# EAGLE schematic aquapi2 (EAGLE 9.6.2)
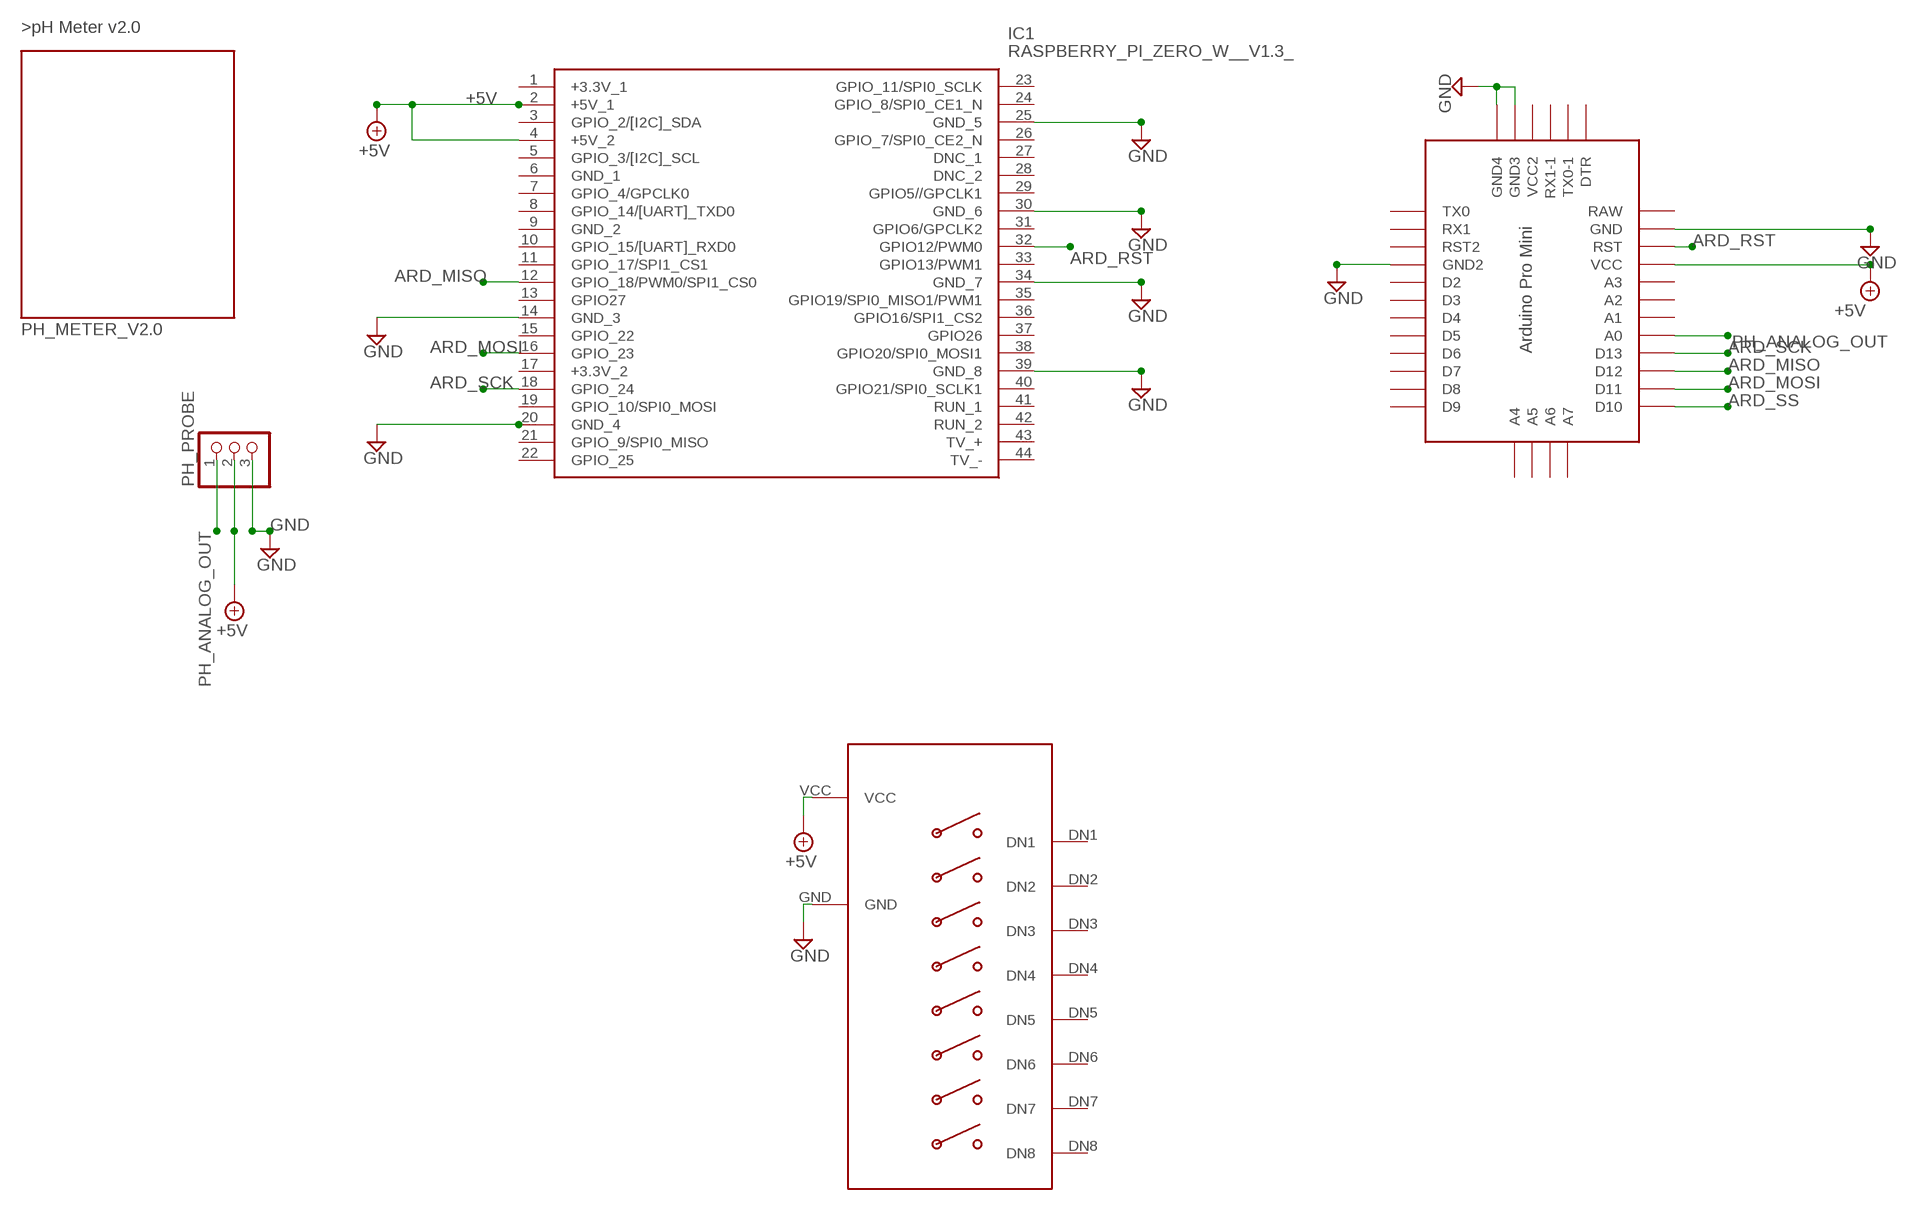
[diagram p0: schematic, sheet 1]

## Parts
IC1  RASPBERRY_PI_ZERO_W__V1.3_  [RASPBERRYPIZEROWV13]
PH_PROBE  PINHD-1X3  [1X03]
U$1  PH_METER_V2.0  [PH_METER_V2.0]
U$2  PRO-MINI  [PRO-MINI]
U$3  RELAY_X8  [RELAY_X8]

## Nets
+5V: IC1.2(+5V_1) IC1.4(+5V_2) PH_PROBE.2 U$2.VCC U$3.VCC
ARD_MISO: IC1.12(GPIO_18/PWM0/SPI1_CS0) U$2.D12
ARD_MOSI: IC1.16(GPIO_23) U$2.D11
ARD_RST: IC1.32(GPIO12/PWM0) U$2.RST
ARD_SCK: IC1.18(GPIO_24) U$2.D13
ARD_SS: U$2.D10
GND: IC1.14(GND_3) IC1.20(GND_4) IC1.25(GND_5) IC1.30(GND_6) IC1.34(GND_7) IC1.39(GND_8) PH_PROBE.3 U$2.GND U$2.GND1(GND2) U$2.GND2(GND4) U$2.GND3 U$3.GND
PH_ANALOG_OUT: PH_PROBE.1 U$2.A0
Unconnected: IC1.1(+3.3V_1) IC1.3(GPIO_2/[I2C]_SDA) IC1.5(GPIO_3/[I2C]_SCL) IC1.6(GND_1) IC1.7(GPIO_4/GPCLK0) IC1.8(GPIO_14/[UART]_TXD0) IC1.9(GND_2) IC1.10(GPIO_15/[UART]_RXD0) IC1.11(GPIO_17/SPI1_CS1) IC1.13(GPIO27) IC1.15(GPIO_22) IC1.17(+3.3V_2) IC1.19(GPIO_10/SPI0_MOSI) IC1.21(GPIO_9/SPI0_MISO) IC1.22(GPIO_25) IC1.23(GPIO_11/SPI0_SCLK) IC1.24(GPIO_8/SPI0_CE1_N) IC1.26(GPIO_7/SPI0_CE2_N) IC1.27(DNC_1) IC1.28(DNC_2) IC1.29(GPIO5//GPCLK1) IC1.31(GPIO6/GPCLK2) IC1.33(GPIO13/PWM1) IC1.35(GPIO19/SPI0_MISO1/PWM1) IC1.36(GPIO16/SPI1_CS2) IC1.37(GPIO26) IC1.38(GPIO20/SPI0_MOSI1) IC1.40(GPIO21/SPI0_SCLK1) IC1.41(RUN_1) IC1.42(RUN_2) IC1.43(TV_+) IC1.44(TV_-) U$2.A1 U$2.A2 U$2.A3 U$2.A4 U$2.A5 U$2.A6 U$2.A7 U$2.D2 U$2.D3 U$2.D4 U$2.D5 U$2.D6 U$2.D7 U$2.D8 U$2.D9 U$2.DTR U$2.RST1(RST2) U$2.RX1 U$2.RX1-1 U$2.TX0 U$2.TX0-1 U$2.VCC1(VCC2) U$3.DN1 U$3.DN2 U$3.DN3 U$3.DN4 U$3.DN5 U$3.DN6 U$3.DN7 U$3.DN8

## Power pins joined to a net without a drawn wire
RAW: U$2.RAW

## Library data of the parts
IC1 = Raspberry_Pi_Zero_W__v1.3_:RASPBERRY_PI_ZERO_W__V1.3_: Raspberry Pi Zero W (v1.3) Single-board Computers Source: Datasheet <https://cdn.sparkfun.com/assets/learn_tutorials/6/7/6/PiZero_1.pdf>; DESCRIPTION: Raspberry Pi Zero W (v1.3) Single-board Computers; HEIGHT: mm; MANUFACTURER_NAME: RASPBERRY-PI; MANUFACTURER_PART_NUMBER: Raspberry Pi Zero W (v1.3)
PH_PROBE = pinhead:PINHD-1X3: PIN HEADER
U$1 = dforbot:PH_METER_V2.0: PH METER V2.0
U$2 = Arduino-clone:PRO-MINI: Arduion Pro Mini Clone V1.0 www.betemcu.cu
U$3 = RELAYx8:RELAY_X8